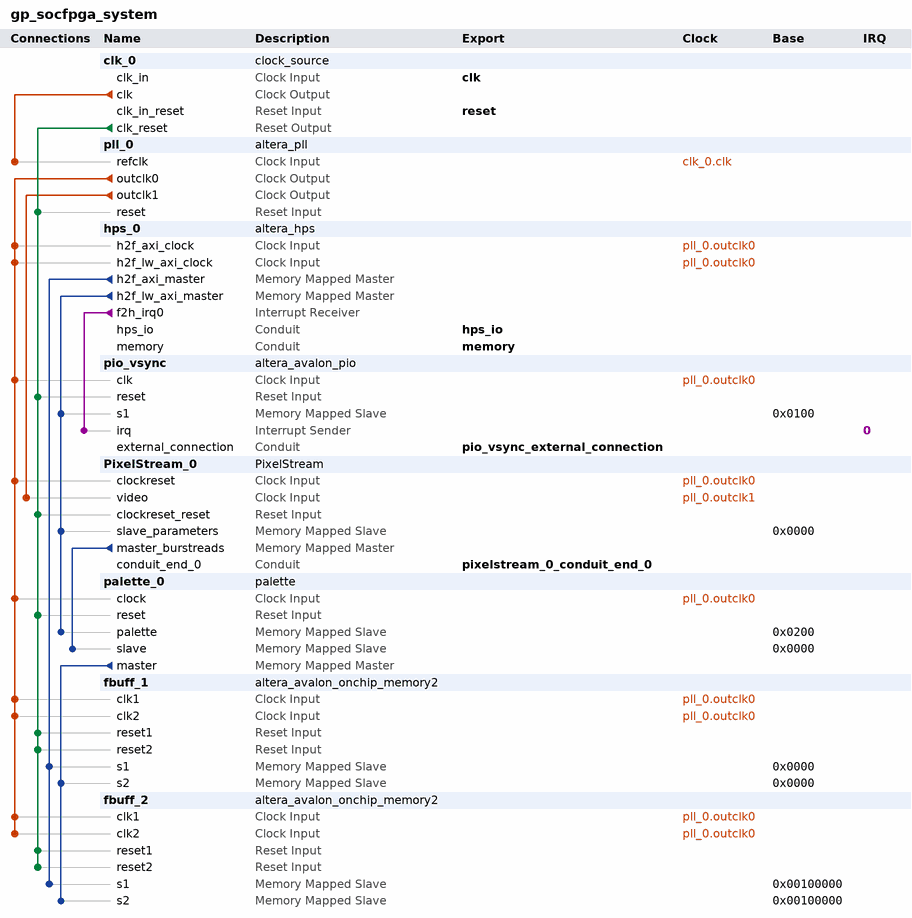
[diagram p0: system contents]
# Platform Designer (Qsys) system gp_socfpga_system, Cyclone V 5CSEMA5F31C6
# Parameters at their usual value, and those the tool derives, are not listed.
package require -exact qsys 16.1
create_system gp_socfpga_system
set_project_property DEVICE_FAMILY {Cyclone V}
set_project_property DEVICE 5CSEMA5F31C6

add_instance clk_0 clock_source 16.1
set_instance_parameter_value clk_0 clockFrequency 50000000

add_instance pll_0 altera_pll 16.1
set_instance_parameter_value pll_0 gui_actual_output_clock_frequency0 {95.000000 MHz}
set_instance_parameter_value pll_0 gui_device_speed_grade 2
set_instance_parameter_value pll_0 gui_number_of_clocks 2
set_instance_parameter_value pll_0 gui_operation_mode direct
set_instance_parameter_value pll_0 gui_output_clock_frequency0 75.0
set_instance_parameter_value pll_0 gui_output_clock_frequency1 9.0
set_instance_parameter_value pll_0 gui_pll_mode {Integer-N PLL}
set_instance_parameter_value pll_0 gui_reference_clock_frequency 50.0
set_instance_parameter_value pll_0 gui_use_locked false

add_instance hps_0 altera_hps 16.1
set_instance_parameter_value hps_0 EMAC1_Mode RGMII
set_instance_parameter_value hps_0 EMAC1_PinMuxing {HPS I/O Set 0}
set_instance_parameter_value hps_0 F2SCLK_COLDRST_Enable false
set_instance_parameter_value hps_0 F2SCLK_DBGRST_Enable false
set_instance_parameter_value hps_0 F2SCLK_WARMRST_Enable false
set_instance_parameter_value hps_0 F2SINTERRUPT_Enable true
set_instance_parameter_value hps_0 F2S_Width 0
set_instance_parameter_value hps_0 FPGA_PERIPHERAL_OUTPUT_CLOCK_FREQ_EMAC0_GTX_CLK 125
set_instance_parameter_value hps_0 FPGA_PERIPHERAL_OUTPUT_CLOCK_FREQ_EMAC0_MD_CLK 2.5
set_instance_parameter_value hps_0 FPGA_PERIPHERAL_OUTPUT_CLOCK_FREQ_EMAC1_GTX_CLK 125
set_instance_parameter_value hps_0 FPGA_PERIPHERAL_OUTPUT_CLOCK_FREQ_EMAC1_MD_CLK 2.5
set_instance_parameter_value hps_0 HPS_PROTOCOL DDR3
set_instance_parameter_value hps_0 I2C0_Mode I2C
set_instance_parameter_value hps_0 I2C0_PinMuxing {HPS I/O Set 0}
set_instance_parameter_value hps_0 I2C1_Mode I2C
set_instance_parameter_value hps_0 I2C1_PinMuxing {HPS I/O Set 0}
set_instance_parameter_value hps_0 LWH2F_Enable true
set_instance_parameter_value hps_0 MEM_BANKADDR_WIDTH 3
set_instance_parameter_value hps_0 MEM_CLK_FREQ 400.0
set_instance_parameter_value hps_0 MEM_COL_ADDR_WIDTH 10
set_instance_parameter_value hps_0 MEM_DQ_WIDTH 32
set_instance_parameter_value hps_0 MEM_DRV_STR RZQ/7
set_instance_parameter_value hps_0 MEM_ROW_ADDR_WIDTH 15
set_instance_parameter_value hps_0 MEM_RTT_NOM RZQ/4
set_instance_parameter_value hps_0 MEM_RTT_WR RZQ/4
set_instance_parameter_value hps_0 MEM_TCL 11
set_instance_parameter_value hps_0 MEM_TFAW_NS 30.0
set_instance_parameter_value hps_0 MEM_TRAS_NS 35.0
set_instance_parameter_value hps_0 MEM_TRCD_NS 13.75
set_instance_parameter_value hps_0 MEM_TRFC_NS 260.0
set_instance_parameter_value hps_0 MEM_TRP_NS 13.75
set_instance_parameter_value hps_0 MEM_VENDOR JEDEC
set_instance_parameter_value hps_0 MEM_WTCL 8
set_instance_parameter_value hps_0 QSPI_Mode {1 SS}
set_instance_parameter_value hps_0 QSPI_PinMuxing {HPS I/O Set 0}
set_instance_parameter_value hps_0 REF_CLK_FREQ 25.0
set_instance_parameter_value hps_0 S2FCLK_USER2CLK 5
set_instance_parameter_value hps_0 S2F_Width 2
set_instance_parameter_value hps_0 SDIO_Mode {4-bit Data}
set_instance_parameter_value hps_0 SDIO_PinMuxing {HPS I/O Set 0}
set_instance_parameter_value hps_0 SPIM1_Mode {Single Slave Select}
set_instance_parameter_value hps_0 SPIM1_PinMuxing {HPS I/O Set 0}
set_instance_parameter_value hps_0 STM_Enable false
set_instance_parameter_value hps_0 TIMING_BOARD_AC_SKEW 0.03
set_instance_parameter_value hps_0 TIMING_BOARD_AC_TO_CK_SKEW 0.0
set_instance_parameter_value hps_0 TIMING_BOARD_DQ_TO_DQS_SKEW 0.0
set_instance_parameter_value hps_0 TIMING_BOARD_MAX_CK_DELAY 0.03
set_instance_parameter_value hps_0 TIMING_BOARD_MAX_DQS_DELAY 0.02
set_instance_parameter_value hps_0 TIMING_BOARD_SKEW_BETWEEN_DQS 0.08
set_instance_parameter_value hps_0 TIMING_BOARD_SKEW_CKDQS_DIMM_MAX 0.16
set_instance_parameter_value hps_0 TIMING_BOARD_SKEW_CKDQS_DIMM_MIN 0.09
set_instance_parameter_value hps_0 TIMING_BOARD_SKEW_WITHIN_DQS 0.01
set_instance_parameter_value hps_0 TIMING_TDH 65
set_instance_parameter_value hps_0 TIMING_TDQSCK 255
set_instance_parameter_value hps_0 TIMING_TDQSQ 125
set_instance_parameter_value hps_0 TIMING_TDS 30
set_instance_parameter_value hps_0 TIMING_TIH 140
set_instance_parameter_value hps_0 TIMING_TIS 180
set_instance_parameter_value hps_0 TIMING_TQSH 0.4
set_instance_parameter_value hps_0 UART0_Mode {No Flow Control}
set_instance_parameter_value hps_0 UART0_PinMuxing {HPS I/O Set 0}
set_instance_parameter_value hps_0 USB1_Mode SDR
set_instance_parameter_value hps_0 USB1_PinMuxing {HPS I/O Set 0}
set_instance_parameter_value hps_0 desired_cfg_clk_mhz 100.0
set_instance_parameter_value hps_0 desired_qspi_clk_mhz 400.0

add_instance pio_vsync altera_avalon_pio 16.1
set_instance_parameter_value pio_vsync captureEdge true
set_instance_parameter_value pio_vsync direction Input
set_instance_parameter_value pio_vsync edgeType FALLING
set_instance_parameter_value pio_vsync generateIRQ true
set_instance_parameter_value pio_vsync irqType EDGE
set_instance_parameter_value pio_vsync width 1

add_instance PixelStream_0 PixelStream 1.0

add_instance palette_0 palette 1.0
set_instance_parameter_value palette_0 NUM_CORES 1

add_instance fbuff_1 altera_avalon_onchip_memory2 16.1
set_instance_parameter_value fbuff_1 dataWidth 32
set_instance_parameter_value fbuff_1 dualPort true
set_instance_parameter_value fbuff_1 initMemContent true
set_instance_parameter_value fbuff_1 initializationFileName onchip_mem.hex
set_instance_parameter_value fbuff_1 memorySize 130560

add_instance fbuff_2 altera_avalon_onchip_memory2 16.1
set_instance_parameter_value fbuff_2 dataWidth 32
set_instance_parameter_value fbuff_2 dualPort true
set_instance_parameter_value fbuff_2 initMemContent true
set_instance_parameter_value fbuff_2 initializationFileName onchip_mem.hex
set_instance_parameter_value fbuff_2 memorySize 130560

# connections
add_connection clk_0.clk pll_0.refclk clock
add_connection pll_0.outclk0 fbuff_1.clk1 clock
add_connection pll_0.outclk0 fbuff_1.clk2 clock
add_connection pll_0.outclk0 fbuff_2.clk1 clock
add_connection pll_0.outclk0 fbuff_2.clk2 clock
add_connection pll_0.outclk0 hps_0.h2f_axi_clock clock
add_connection pll_0.outclk0 hps_0.h2f_lw_axi_clock clock
add_connection pll_0.outclk0 palette_0.clock clock
add_connection pll_0.outclk0 pio_vsync.clk clock
add_connection pll_0.outclk0 PixelStream_0.clockreset clock
add_connection pll_0.outclk1 PixelStream_0.video clock
add_connection clk_0.clk_reset fbuff_1.reset1 reset
add_connection clk_0.clk_reset fbuff_1.reset2 reset
add_connection clk_0.clk_reset fbuff_2.reset1 reset
add_connection clk_0.clk_reset fbuff_2.reset2 reset
add_connection clk_0.clk_reset palette_0.reset reset
add_connection clk_0.clk_reset pio_vsync.reset reset
add_connection clk_0.clk_reset PixelStream_0.clockreset_reset reset
add_connection clk_0.clk_reset pll_0.reset reset
add_connection hps_0.h2f_axi_master fbuff_1.s1 avalon
set_connection_parameter_value hps_0.h2f_axi_master/fbuff_1.s1 baseAddress 0x0000
add_connection hps_0.h2f_axi_master fbuff_2.s1 avalon
set_connection_parameter_value hps_0.h2f_axi_master/fbuff_2.s1 baseAddress 0x00100000
add_connection hps_0.h2f_lw_axi_master palette_0.palette avalon
set_connection_parameter_value hps_0.h2f_lw_axi_master/palette_0.palette baseAddress 0x0200
add_connection hps_0.h2f_lw_axi_master pio_vsync.s1 avalon
set_connection_parameter_value hps_0.h2f_lw_axi_master/pio_vsync.s1 baseAddress 0x0100
add_connection hps_0.h2f_lw_axi_master PixelStream_0.slave_parameters avalon
set_connection_parameter_value hps_0.h2f_lw_axi_master/PixelStream_0.slave_parameters baseAddress 0x0000
add_connection palette_0.master fbuff_1.s2 avalon
set_connection_parameter_value palette_0.master/fbuff_1.s2 baseAddress 0x0000
add_connection palette_0.master fbuff_2.s2 avalon
set_connection_parameter_value palette_0.master/fbuff_2.s2 baseAddress 0x00100000
add_connection PixelStream_0.master_burstreads palette_0.slave avalon
set_connection_parameter_value PixelStream_0.master_burstreads/palette_0.slave baseAddress 0x0000
add_connection hps_0.f2h_irq0 pio_vsync.irq interrupt
set_connection_parameter_value hps_0.f2h_irq0/pio_vsync.irq irqNumber 0

# exported interfaces
add_interface clk clock sink
set_interface_property clk EXPORT_OF clk_0.clk_in
add_interface hps_io conduit end
set_interface_property hps_io EXPORT_OF hps_0.hps_io
add_interface memory conduit end
set_interface_property memory EXPORT_OF hps_0.memory
add_interface pio_vsync_external_connection conduit end
set_interface_property pio_vsync_external_connection EXPORT_OF pio_vsync.external_connection
add_interface pixelstream_0_conduit_end_0 conduit end
set_interface_property pixelstream_0_conduit_end_0 EXPORT_OF PixelStream_0.conduit_end_0
add_interface reset reset sink
set_interface_property reset EXPORT_OF clk_0.clk_in_reset

set_interconnect_requirement {$system} qsys_mm.clockCrossingAdapter HANDSHAKE
set_interconnect_requirement {$system} qsys_mm.enableEccProtection FALSE
set_interconnect_requirement {$system} qsys_mm.insertDefaultSlave FALSE
set_interconnect_requirement {$system} qsys_mm.maxAdditionalLatency 1

save_system gp_socfpga_system.qsys
